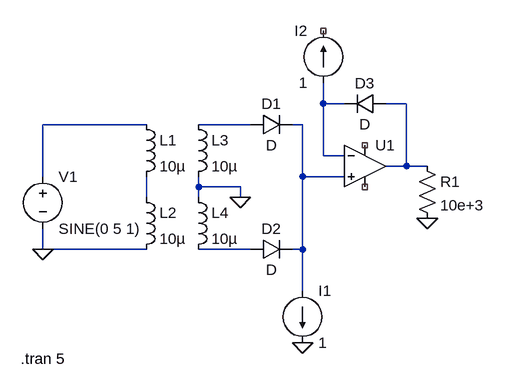
[diagram p0: schematic Draft1.asc]
Draft1.asc, the LTspice schematic file:
Version 4
SHEET 1 880 680
WIRE 400 16 400 -16
WIRE 432 16 400 16
WIRE 528 16 496 16
WIRE 128 48 -32 48
WIRE 288 48 208 48
WIRE 368 48 352 48
WIRE 400 96 400 16
WIRE 432 96 400 96
WIRE 528 112 528 16
WIRE 528 112 496 112
WIRE 560 112 528 112
WIRE -32 128 -32 48
WIRE 368 128 368 48
WIRE 432 128 368 128
WIRE 208 144 208 128
WIRE 272 144 208 144
WIRE 128 160 128 128
WIRE 208 160 208 144
WIRE 272 160 272 144
WIRE -32 240 -32 208
WIRE 128 240 -32 240
WIRE 288 240 208 240
WIRE 368 240 368 128
WIRE 368 240 352 240
WIRE 368 304 368 240
FLAG 272 160 0
FLAG -32 240 0
FLAG 560 192 0
FLAG 368 384 0
SYMBOL voltage -32 112 R0
WINDOW 123 0 0 Left 0
WINDOW 39 0 0 Left 0
SYMATTR InstName V1
SYMATTR Value SINE(0 5 1)
SYMBOL ind 112 32 R0
SYMATTR InstName L1
SYMATTR Value 10µ
SYMBOL ind 112 144 R0
SYMATTR InstName L2
SYMATTR Value 10µ
SYMBOL ind 192 32 R0
SYMATTR InstName L3
SYMATTR Value 10µ
SYMBOL ind 192 144 R0
SYMATTR InstName L4
SYMATTR Value 10µ
SYMBOL diode 288 64 R270
WINDOW 0 32 32 VTop 2
WINDOW 3 0 32 VBottom 2
SYMATTR InstName D1
SYMBOL diode 288 256 R270
WINDOW 0 32 32 VTop 2
WINDOW 3 0 32 VBottom 2
SYMATTR InstName D2
SYMBOL OpAmps\\UniversalOpAmp 464 112 R0
SYMATTR InstName U1
SYMBOL diode 496 0 R90
WINDOW 0 0 32 VBottom 2
WINDOW 3 32 32 VTop 2
SYMATTR InstName D3
SYMBOL current 368 304 R0
WINDOW 123 0 0 Left 0
WINDOW 39 0 0 Left 0
SYMATTR InstName I1
SYMATTR Value 1
SYMBOL current 400 -16 R180
WINDOW 0 24 80 Left 2
WINDOW 3 24 0 Left 2
WINDOW 123 0 0 Left 0
WINDOW 39 0 0 Left 0
SYMATTR InstName I2
SYMATTR Value 1
SYMBOL res 544 96 R0
SYMATTR InstName R1
SYMATTR Value 10e+3
TEXT -66 408 Left 2 !.tran 5

The netlist it stands for:
* Draft1.asc
V1 N003 0 SINE(0 5 1)
L1 N003 N006 10µ
L2 N006 0 10µ
L3 N004 0 10µ
L4 0 N007 10µ
D1 N004 N005 D
D2 N007 N005 D
XU1 N005 N001 NC_01 NC_02 N002 level1 Avol=1Meg GBW=10Meg Vos=0 En=0 Enk=0 In=0 Ink=0 Rin=500Meg  ; pins In+ In- V+ V- OUT
D3 N002 N001 D
I1 N005 0 1
I2 N001 NC_03 1
R1 N002 0 10e+3
.model D D
.lib standard.dio
.tran 5
.lib UniversalOpAmp1.lib
.backanno
.end